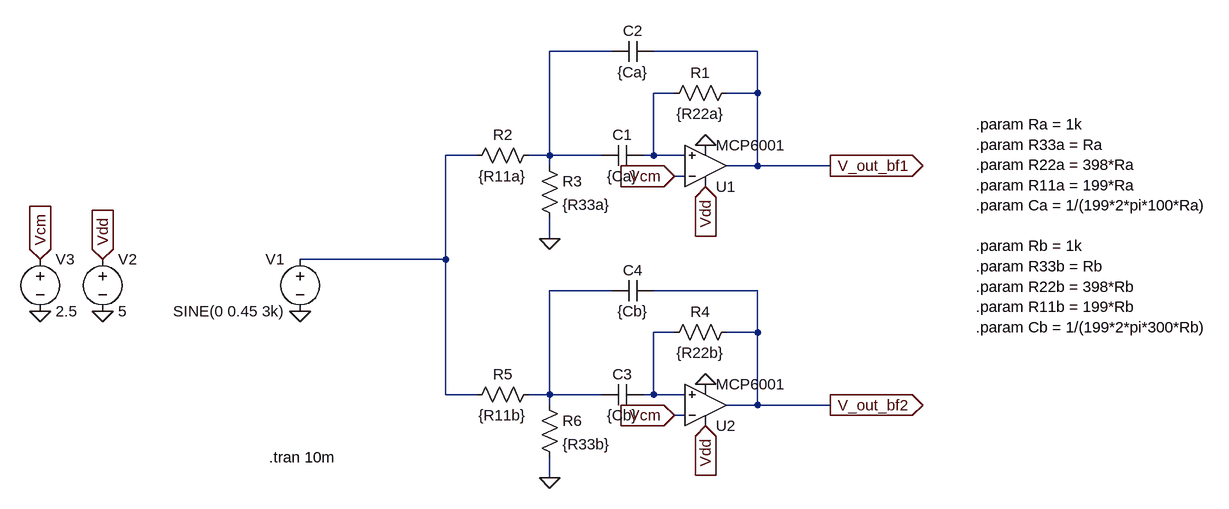
[diagram p0: schematic Expt6.asc]
Expt6.asc, the LTspice schematic file:
Version 4
SHEET 1 880 680
WIRE 96 -16 0 -16
WIRE 320 -16 160 -16
WIRE 192 48 160 48
WIRE 320 48 320 -16
WIRE 320 48 272 48
WIRE -112 144 -160 144
WIRE 0 144 0 -16
WIRE 0 144 -32 144
WIRE 80 144 0 144
WIRE 160 144 160 48
WIRE 160 144 144 144
WIRE 208 144 160 144
WIRE 0 160 0 144
WIRE 320 160 320 48
WIRE 320 160 272 160
WIRE 432 160 320 160
WIRE 208 176 192 176
WIRE 0 272 0 240
WIRE -160 304 -160 144
WIRE -160 304 -384 304
WIRE 96 352 0 352
WIRE 320 352 160 352
WIRE 192 416 160 416
WIRE 320 416 320 352
WIRE 320 416 272 416
WIRE -160 512 -160 304
WIRE -112 512 -160 512
WIRE 0 512 0 352
WIRE 0 512 -32 512
WIRE 80 512 0 512
WIRE 160 512 160 416
WIRE 160 512 144 512
WIRE 208 512 160 512
WIRE 0 528 0 512
WIRE 320 528 320 416
WIRE 320 528 272 528
WIRE 432 528 320 528
WIRE 208 544 192 544
WIRE 0 640 0 608
FLAG 240 128 0
FLAG 240 192 Vdd
IOPIN 240 192 In
FLAG 0 272 0
FLAG 240 496 0
FLAG 240 560 Vdd
IOPIN 240 560 In
FLAG 0 640 0
FLAG 432 160 V_out_bf1
IOPIN 432 160 Out
FLAG 432 528 V_out_bf2
IOPIN 432 528 Out
FLAG -384 384 0
FLAG 192 544 Vcm
IOPIN 192 544 In
FLAG 192 176 Vcm
IOPIN 192 176 In
FLAG -688 384 0
FLAG -784 384 0
FLAG -784 304 Vcm
IOPIN -784 304 In
FLAG -688 304 Vdd
IOPIN -688 304 In
SYMBOL MCP6001 240 160 M180
SYMATTR InstName U1
SYMBOL cap 144 160 M270
WINDOW 0 32 32 VTop 2
WINDOW 3 0 32 VBottom 2
SYMATTR InstName C1
SYMATTR Value {Ca}
SYMBOL cap 160 0 M270
WINDOW 0 32 32 VTop 2
WINDOW 3 0 32 VBottom 2
SYMATTR InstName C2
SYMATTR Value {Ca}
SYMBOL res 288 32 R90
WINDOW 0 0 56 VBottom 2
WINDOW 3 32 56 VTop 2
SYMATTR InstName R1
SYMATTR Value {R22a}
SYMBOL res -16 128 R90
WINDOW 0 0 56 VBottom 2
WINDOW 3 32 56 VTop 2
SYMATTR InstName R2
SYMATTR Value {R11a}
SYMBOL res -16 144 R0
SYMATTR InstName R3
SYMATTR Value {R33a}
SYMBOL MCP6001 240 528 M180
SYMATTR InstName U2
SYMBOL cap 144 528 M270
WINDOW 0 32 32 VTop 2
WINDOW 3 0 32 VBottom 2
SYMATTR InstName C3
SYMATTR Value {Cb}
SYMBOL cap 160 368 M270
WINDOW 0 32 32 VTop 2
WINDOW 3 0 32 VBottom 2
SYMATTR InstName C4
SYMATTR Value {Cb}
SYMBOL res 288 400 R90
WINDOW 0 0 56 VBottom 2
WINDOW 3 32 56 VTop 2
SYMATTR InstName R4
SYMATTR Value {R22b}
SYMBOL res -16 496 R90
WINDOW 0 0 56 VBottom 2
WINDOW 3 32 56 VTop 2
SYMATTR InstName R5
SYMATTR Value {R11b}
SYMBOL res -16 512 R0
SYMATTR InstName R6
SYMATTR Value {R33b}
SYMBOL voltage -384 288 M0
WINDOW 123 0 0 Left 0
WINDOW 39 0 0 Left 0
SYMATTR InstName V1
SYMATTR Value SINE(0 0.45 3k)
SYMBOL voltage -688 288 R0
WINDOW 123 0 0 Left 0
WINDOW 39 0 0 Left 0
SYMATTR InstName V2
SYMATTR Value 5
SYMBOL voltage -784 288 R0
WINDOW 123 0 0 Left 0
WINDOW 39 0 0 Left 0
SYMATTR InstName V3
SYMATTR Value 2.5
TEXT 656 96 Left 2 !.param Ra = 1k\n.param R33a = Ra\n.param R22a = 398*Ra\n.param R11a = 199*Ra\n.param Ca = 1/(199*2*pi*100*Ra)\n \n.param Rb = 1k\n.param R33b = Rb\n.param R22b = 398*Rb\n.param R11b = 199*Rb\n.param Cb = 1/(199*2*pi*300*Rb)
TEXT -432 608 Left 2 !.tran 10m

The netlist it stands for:
* Expt6.asc
* U1: MCP6001 (symbol MCP6001 not available, pins judged from their places): In+=N002 In-=Vcm V+=Vdd V-=0 OUT=V_out_bf1
C1 N002 N001 {Ca}
C2 V_out_bf1 N001 {Ca}
R1 V_out_bf1 N002 {R22a}
R2 N001 N003 {R11a}
R3 N001 0 {R33a}
* U2: MCP6001 (symbol MCP6001 not available, pins judged from their places): In+=N005 In-=Vcm V+=Vdd V-=0 OUT=V_out_bf2
C3 N005 N004 {Cb}
C4 V_out_bf2 N004 {Cb}
R4 V_out_bf2 N005 {R22b}
R5 N004 N003 {R11b}
R6 N004 0 {R33b}
V1 N003 0 SINE(0 0.45 3k)
V2 Vdd 0 5
V3 Vcm 0 2.5
.param Ra = 1k
.param R33a = Ra
.param R22a = 398*Ra
.param R11a = 199*Ra
.param Ca = 1/(199*2*pi*100*Ra)
.param Rb = 1k
.param R33b = Rb
.param R22b = 398*Rb
.param R11b = 199*Rb
.param Cb = 1/(199*2*pi*300*Rb)
.tran 10m
.backanno
.end